# EAGLE schematic AD5941_testboard (EAGLE 8.4.0)
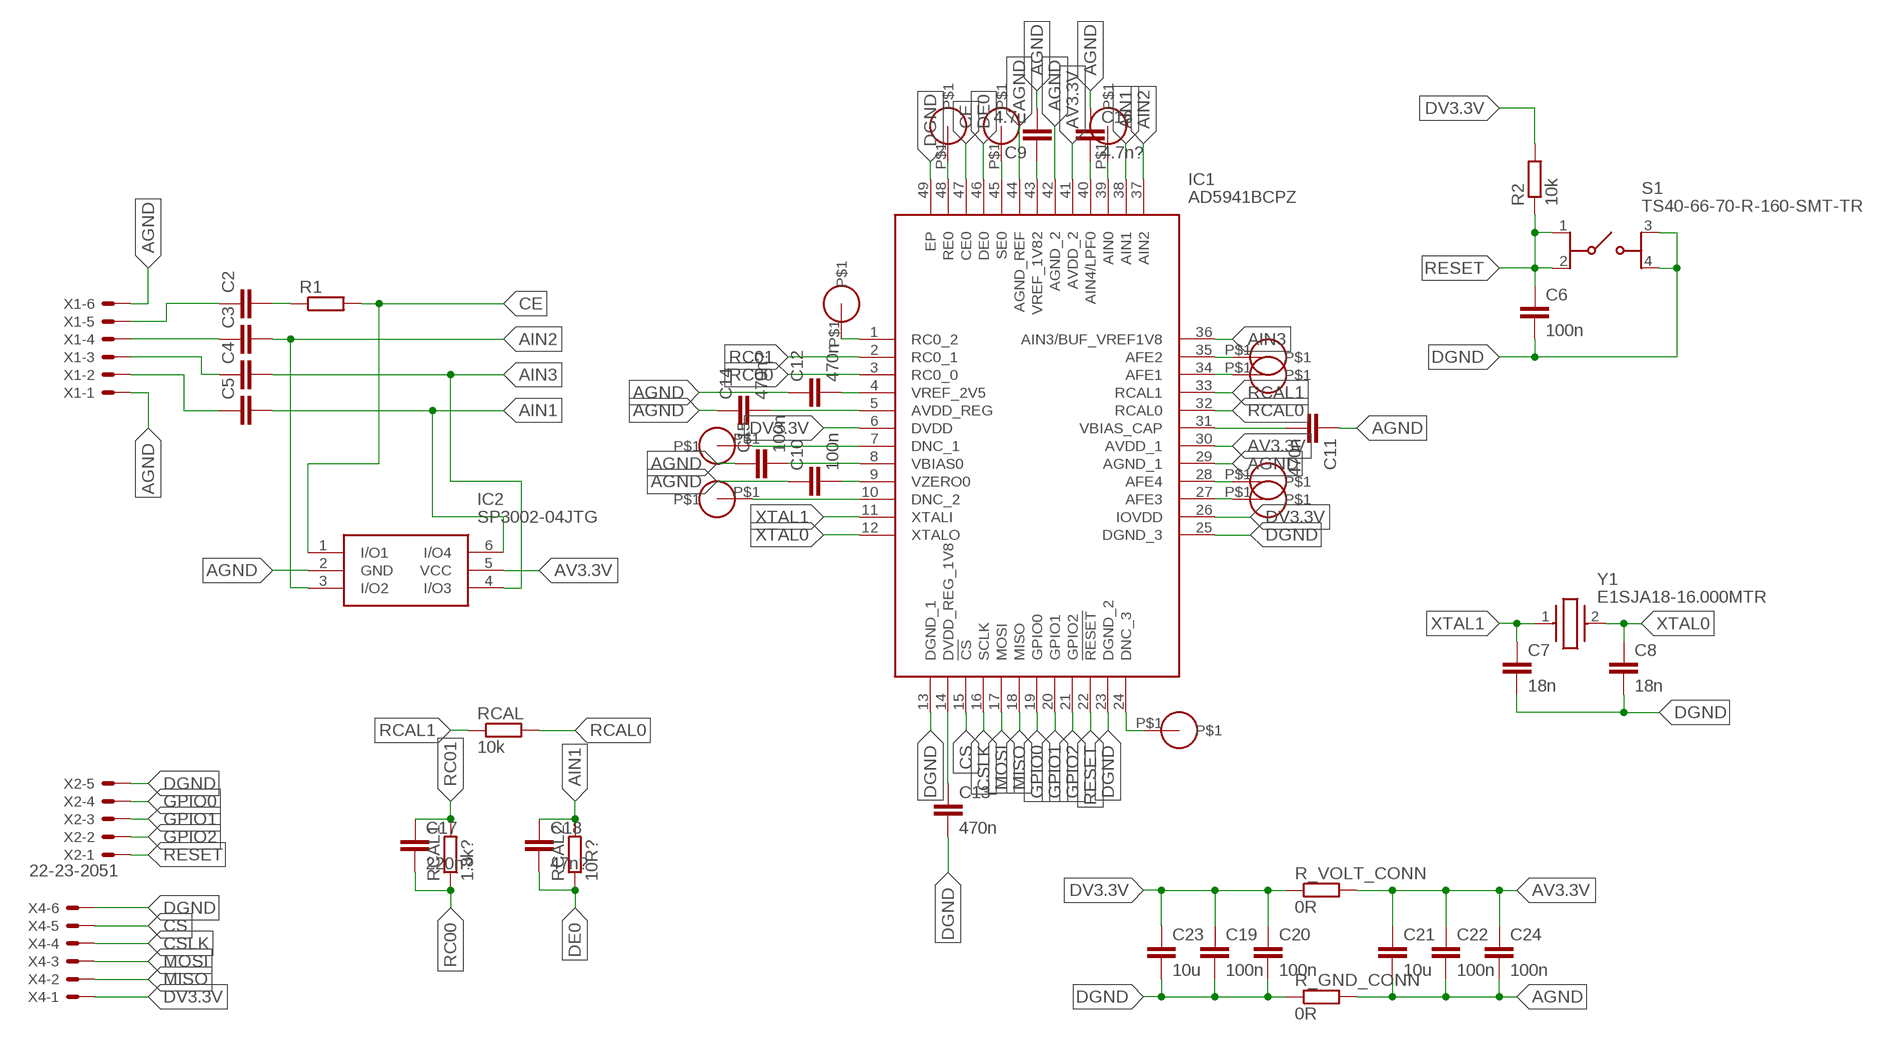
[diagram p0: schematic, sheet 1]

## Parts
C2  C-EUC0805  [C0805]
C3  C-EUC0805  [C0805]
C4  C-EUC0805  [C0805]
C5  C-EUC0805  [C0805]
C6  100n  C-EUC0805  [C0805]
C7  18n  C-EUC0805  [C0805]
C8  18n  C-EUC0805  [C0805]
C9  4.7u  C-EUC0805  [C0805]
C10  100n  C-EUC0805  [C0805]
C11  470n  C-EUC0805  [C0805]
C12  470n  C-EUC0805  [C0805]
C13  470n  C-EUC0805  [C0805]
C14  470n?  C-EUC0805  [C0805]
C15  100n  C-EUC0805  [C0805]
C16  4.7n?  C-EUC0805  [C0805]
C17  220n?  C-EUC0805  [C0805]
C18  47n?  C-EUC0805  [C0805]
C19  100n  C-EUC0805  [C0805]
C20  100n  C-EUC0805  [C0805]
C21  10u  C-EUC0805  [C0805]
C22  100n  C-EUC0805  [C0805]
C23  10u  C-EUC0805  [C0805]
C24  100n  C-EUC0805  [C0805]
IC1  AD5941BCPZ  [QFN50P700X700X80-49N]
IC2  SP3002-04JTG  [SOT65P220X110-6N]
R1  R-EU_R0603  [R0603]
R2  10k  R-EU_R0603  [R0603]
R_GND_CONN  0R  R-EU_R0603  [R0603]
R_VOLT_CONN  0R  R-EU_R0603  [R0603]
RCAL  10k  R-EU_R0603  [R0603]
RCAL1  1.8k?  R-EU_R0603  [R0603]
RCAL2  10R?  R-EU_R0603  [R0603]
S1  TS40-66-70-R-160-SMT-TR  [TS406670R160SMTTR]
U$1  1XPIN+HOLE  [1XPIN+HOLE]
U$2  1XPIN+HOLE  [1XPIN+HOLE]
U$3  1XPIN+HOLE  [1XPIN+HOLE]
U$4  1XPIN+HOLE  [1XPIN+HOLE]
U$5  1XPIN+HOLE  [1XPIN+HOLE]
U$6  1XPIN+HOLE  [1XPIN+HOLE]
U$7  1XPIN+HOLE  [1XPIN+HOLE]
U$8  1XPIN+HOLE  [1XPIN+HOLE]
U$9  1XPIN+HOLE  [1XPIN+HOLE]
U$10  1XPIN+HOLE  [1XPIN+HOLE]
U$11  1XPIN+HOLE  [1XPIN+HOLE]
X1  22-23-2061  [22-23-2061]
X2  22-23-2051  [22-23-2051]
X4  22-23-2061  [22-23-2061]
Y1  E1SJA18-16.000MTR  [E1SJA1816000MTR]

## Nets
AGND: C9.2 C10.1 C11.1 C12.1 C14.1 C15.1 C16.1 C21.2 C22.2 C24.2 IC1.29(AGND_1) IC1.42(AGND_2) IC1.44(AGND_REF) IC2.2(GND) R_GND_CONN.2 X1.1 X1.6
AIN1: C5.2 C18.1 IC1.38(AIN1) IC2.6(I/O4) RCAL2.2
AIN2: C3.2 IC1.37(AIN2) IC2.3(I/O2)
AIN3: C4.2 IC1.36(AIN3/BUF_VREF1V8) IC2.4(I/O3)
AV3.3V: C21.1 C22.1 C24.1 IC1.30(AVDD_1) IC1.41(AVDD_2) IC2.5(VCC) R_VOLT_CONN.2
CE: IC1.47(CE0) IC2.1(I/O1) R1.2
CS: IC1.15(!CS) X4.5
CSLK: IC1.16(SCLK) X4.4
DE0: C18.2 IC1.46(DE0) RCAL2.1
DGND: C6.2 C7.2 C8.2 C13.2 C19.2 C20.2 C23.2 IC1.13(DGND_1) IC1.23(DGND_2) IC1.25(DGND_3) IC1.49(EP) R_GND_CONN.1 S1.3(NO_1) S1.4(NO_2) X2.5 X4.6
DV3.3V: C19.1 C20.1 C23.1 IC1.6(DVDD) IC1.26(IOVDD) R2.2 R_VOLT_CONN.1 X4.1
GPIO0: IC1.19(GPIO0) X2.4
GPIO1: IC1.20(GPIO1) X2.3
GPIO2: IC1.21(GPIO2) X2.2
MISO: IC1.18(MISO) X4.2
MOSI: IC1.17(MOSI) X4.3
N$1: C2.2 R1.1
N$2: C2.1 X1.5
N$3: C3.1 X1.4
N$4: C4.1 X1.3
N$5: C5.1 X1.2
N$6: C13.1 IC1.14(DVDD_REG_1V8)
N$7: C12.2 IC1.4(VREF_2V5)
N$8: C11.2 IC1.31(VBIAS_CAP)
N$9: C14.2 IC1.5(AVDD_REG)
N$10: C9.1 IC1.43(VREF_1V82)
N$11: C10.2 IC1.9(VZERO0)
N$12: C15.2 IC1.8(VBIAS0)
N$13: C16.2 IC1.40(AIN4/LPF0)
N$14: IC1.24(DNC_3) U$1.P$1
N$15: IC1.27(AFE3) U$9.P$1
N$16: IC1.28(AFE4) U$10.P$1
N$17: IC1.34(AFE1) U$8.P$1
N$18: IC1.35(AFE2) U$7.P$1
N$19: IC1.10(DNC_2) U$3.P$1
N$20: IC1.1(RC0_2) U$2.P$1
N$21: IC1.7(DNC_1) U$11.P$1
N$22: IC1.48(RE0) U$4.P$1
N$23: IC1.45(SE0) U$5.P$1
N$24: IC1.39(AIN0) U$6.P$1
RC00: C17.2 IC1.3(RC0_0) RCAL1.1
RC01: C17.1 IC1.2(RC0_1) RCAL1.2
RCAL0: IC1.32(RCAL0) RCAL.2
RCAL1: IC1.33(RCAL1) RCAL.1
RESET: C6.1 IC1.22(!RESET) R2.1 S1.1(COM_1) S1.2(COM_2) X2.1
XTAL0: C8.1 IC1.12(XTALO) Y1.2
XTAL1: C7.1 IC1.11(XTALI) Y1.1

## Library data of the parts
C2-C24 = rcl:C-EU: CAPACITOR, European symbol
IC1 = AD5941BCPZ:AD5941BCPZ: High Precision, Impedance & Electrochemical Front End Source: Datasheet <https://www.analog.com/media/en/technical-documentation/data-sheets/AD5940-5941.pdf>; ARROW_PART_NUMBER: AD5941BCPZ; ARROW_PRICE-STOCK: https://www.arrow.com/en/products/ad5941bcpz/analog-devices.html?utm_currency=USD&region=europe; DESCRIPTION: High Precision, Impedance & Electrochemical Front End; HEIGHT: 0.8mm; MANUFACTURER_NAME: Analog Devices; MANUFACTURER_PART_NUMBER: AD5941BCPZ; MOUSER_PART_NUMBER: 584-AD5941BCPZ; MOUSER_PRICE-STOCK: https://www.mouser.co.uk/ProductDetail/Analog-Devices/AD5941BCPZ?qs=B6kkDfuK7%2FDIxZEWBBp0eA%3D%3D
IC2 = SP3002-04JTG:SP3002-04JTG: TVS Diode Array 4 Ch 15kV 1.1pF SC70-6 Source: Datasheet <https://m.littelfuse.com/~/media/electronics/datasheets/tvs_diode_arrays/littelfuse_tvs_diode_array_sp3002_datasheet.pdf.pdf>; ARROW_PART_NUMBER: SP3002-04JTG; ARROW_PRICE-STOCK: https://www.arrow.com/en/products/sp3002-04jtg/littelfuse?region=nac; DESCRIPTION: TVS Diode Array 4 Ch 15kV 1.1pF SC70-6; HEIGHT: 1.1mm; MANUFACTURER_NAME: LITTELFUSE; MANUFACTURER_PART_NUMBER: SP3002-04JTG; MOUSER_PART_NUMBER: 576-SP3002-04JTG; MOUSER_PRICE-STOCK: https://www.mouser.co.uk/ProductDetail/Littelfuse/SP3002-04JTG?qs=Xb8IjHhkxj40Q3K%2Fx81Vbw%3D%3D
R1 R2 R_GND_CONN R_VOLT_CONN RCAL RCAL1 RCAL2 = rcl:R-EU_: RESISTOR, European symbol
S1 = TS40-66-70-R-160-SMT-TR:TS40-66-70-R-160-SMT-TR: 6 x 6 mm, 7 mm Actuator Height Off PCB, 160 gf, Red, Surface Mount, SPST, Tactile Switch -20 +70 C,50mA,12Vdc Source: Datasheet <https://www.sameskydevices.com/product/resource/ts40.pdf>; DESCRIPTION: 6 x 6 mm, 7 mm Actuator Height Off PCB, 160 gf, Red, Surface Mount, SPST, Tactile Switch -20 +70 C,50mA,12Vdc; HEIGHT: 7.1mm; MANUFACTURER_NAME: Same Sky; MANUFACTURER_PART_NUMBER: TS40-66-70-R-160-SMT-TR
U$1-U$11 = Pins_cost:1XPIN+HOLE
X1 X4 = con-molex:22-23-2061: .100" (2.54mm) Center Header - 6 Pin; MF: MOLEX; MPN: 22-23-2061; OC_FARNELL: 1462922; OC_NEWARK: 27C1933
X2 = con-molex:22-23-2051: .100" (2.54mm) Center Header - 5 Pin; MF: MOLEX; MPN: 22-23-2051; OC_FARNELL: 1462952; OC_NEWARK: 38C9178
Y1 = E1SJA18-16.000MTR:E1SJA18-16.000MTR: Crystals Crystals 16.000MHz 15ppm 18pF Parallel Resonant -40 C to +85 C Source: Datasheet <https://abracon.com/datasheets/Ecliptek/E1S.pdf>; DESCRIPTION: Crystals Crystals 16.000MHz 15ppm 18pF Parallel Resonant -40 C to +85 C; HEIGHT: 3.2mm; MANUFACTURER_NAME: ABRACON; MANUFACTURER_PART_NUMBER: E1SJA18-16.000MTR; MOUSER_PART_NUMBER: 815-E1SJA1816000MTR; MOUSER_PRICE-STOCK: https://www.mouser.co.uk/ProductDetail/ABRACON/E1SJA18-16.000MTR?qs=vmHwEFxEFR9FH5YYebvkCg%3D%3D